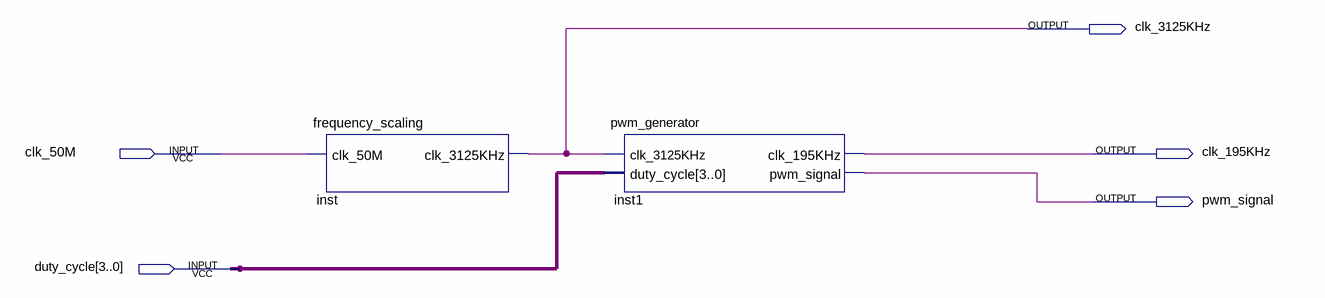
[diagram p0: schematic sheet]
// Quartus schematic t1a_fs_pwm.bdf as structural Verilog: 2 symbols, 5 pins
module t1a_fs_pwm (
  input  clk_50M,
  input  [3:0] duty_cycle,
  output clk_3125KHz,
  output clk_195KHz,
  output pwm_signal
);

  frequency_scaling inst (.clk_50M(clk_50M), .clk_3125KHz(clk_3125KHz));
  pwm_generator inst1 (
    .clk_3125KHz(clk_3125KHz), .duty_cycle(duty_cycle), .clk_195KHz(clk_195KHz), .pwm_signal(pwm_signal));
endmodule
